# EAGLE design STHV800_breakout_board (EAGLE 9.1.3)
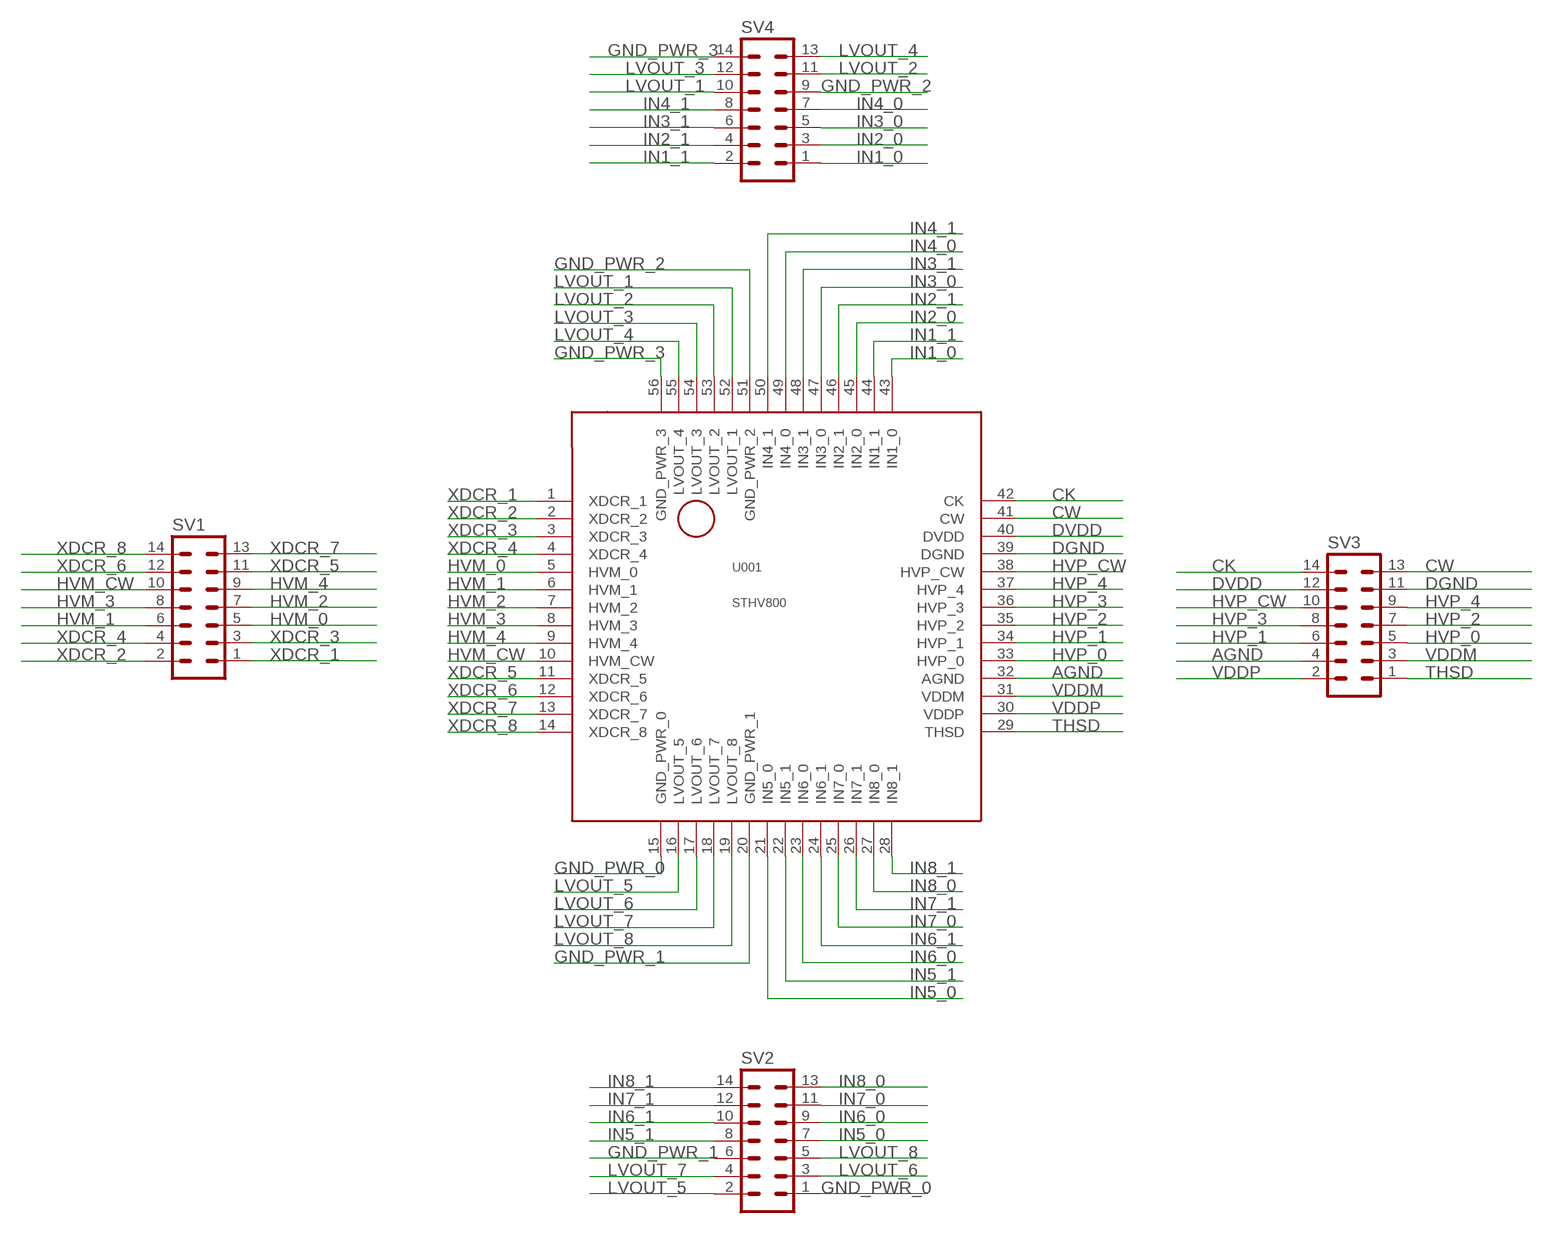
[diagram p0: schematic, sheet 1]

## Parts
SV1  MA07-2  [MA07-2]
SV2  MA07-2  [MA07-2]
SV3  MA07-2  [MA07-2]
SV4  MA07-2  [MA07-2]
U001  STHV800  [STHV800]

## Nets
AGND: SV3.4 U001.32(AGND)
CK: SV3.14 U001.42(CK)
CW: SV3.13 U001.41(CW)
DGND: SV3.11 U001.39(DGND)
DVDD: SV3.12 U001.40(DVDD)
GND_PWR_0: SV2.1 U001.15(GND_PWR_0)
GND_PWR_1: SV2.6 U001.20(GND_PWR_1)
GND_PWR_2: SV4.9 U001.51(GND_PWR_2)
GND_PWR_3: SV4.14 U001.56(GND_PWR_3)
HVM_0: SV1.5 U001.5(HVM_0)
HVM_1: SV1.6 U001.6(HVM_1)
HVM_2: SV1.7 U001.7(HVM_2)
HVM_3: SV1.8 U001.8(HVM_3)
HVM_4: SV1.9 U001.9(HVM_4)
HVM_CW: SV1.10 U001.10(HVM_CW)
HVP_0: SV3.5 U001.33(HVP_0)
HVP_1: SV3.6 U001.34(HVP_1)
HVP_2: SV3.7 U001.35(HVP_2)
HVP_3: SV3.8 U001.36(HVP_3)
HVP_4: SV3.9 U001.37(HVP_4)
HVP_CW: SV3.10 U001.38(HVP_CW)
IN1_0: SV4.1 U001.43(IN1_0)
IN1_1: SV4.2 U001.44(IN1_1)
IN2_0: SV4.3 U001.45(IN2_0)
IN2_1: SV4.4 U001.46(IN2_1)
IN3_0: SV4.5 U001.47(IN3_0)
IN3_1: SV4.6 U001.48(IN3_1)
IN4_0: SV4.7 U001.49(IN4_0)
IN4_1: SV4.8 U001.50(IN4_1)
IN5_0: SV2.7 U001.21(IN5_0)
IN5_1: SV2.8 U001.22(IN5_1)
IN6_0: SV2.9 U001.23(IN6_0)
IN6_1: SV2.10 U001.24(IN6_1)
IN7_0: SV2.11 U001.25(IN7_0)
IN7_1: SV2.12 U001.26(IN7_1)
IN8_0: SV2.13 U001.27(IN8_0)
IN8_1: SV2.14 U001.28(IN8_1)
LVOUT_1: SV4.10 U001.52(LVOUT_1)
LVOUT_2: SV4.11 U001.53(LVOUT_2)
LVOUT_3: SV4.12 U001.54(LVOUT_3)
LVOUT_4: SV4.13 U001.55(LVOUT_4)
LVOUT_5: SV2.2 U001.16(LVOUT_5)
LVOUT_6: SV2.3 U001.17(LVOUT_6)
LVOUT_7: SV2.4 U001.18(LVOUT_7)
LVOUT_8: SV2.5 U001.19(LVOUT_8)
THSD: SV3.1 U001.29(THSD)
VDDM: SV3.3 U001.31(VDDM)
VDDP: SV3.2 U001.30(VDDP)
XDCR_1: SV1.1 U001.1(XDCR_1)
XDCR_2: SV1.2 U001.2(XDCR_2)
XDCR_3: SV1.3 U001.3(XDCR_3)
XDCR_4: SV1.4 U001.4(XDCR_4)
XDCR_5: SV1.11 U001.11(XDCR_5)
XDCR_6: SV1.12 U001.12(XDCR_6)
XDCR_7: SV1.13 U001.13(XDCR_7)
XDCR_8: SV1.14 U001.14(XDCR_8)

## Library data of the parts
SV1-SV4 = con-lstb:MA07-2: PIN HEADER; OC_FARNELL: unknown; OC_NEWARK: unknown
U001 = STHV800:STHV800

## Board
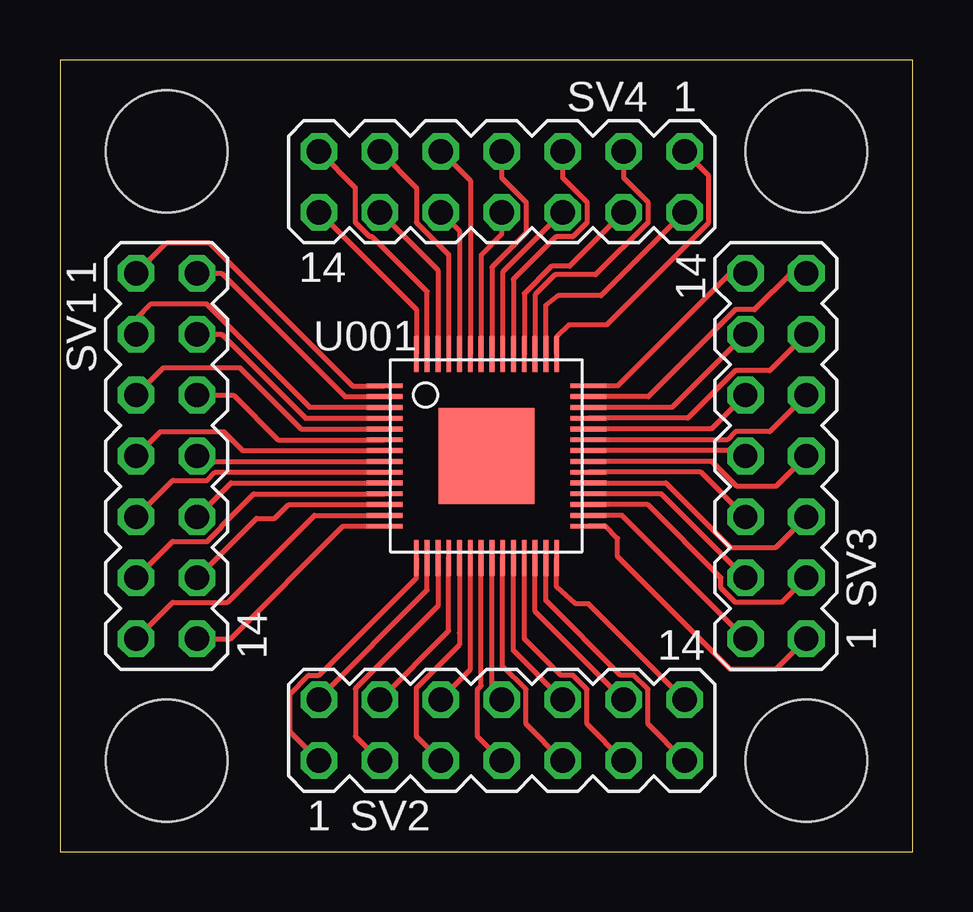
[diagram p1: board, top side]

Size 35.56 x 33.02 mm. Coordinates in mm from the lower left corner, seen from the top.
Outline: 0,0 35.56,0 35.56,33.02 0,33.02 0,0
Copper layers (1*16): Top 0.035mm / dielectric 1.5mm / Bottom 0.035mm
Design rules "default": minimum track width 6mil, minimum drill 0.35mm, track to track 6mil, track to pad 6mil, pad to pad 6mil, via to via 6mil, smd to smd 6mil, copper to edge 40mil, drill to drill 6mil, minimum pad ring 10mil, minimum via ring 8mil, stop-mask expansion 4mil, vias tented up to drill 0mil, thermal gap 10mil
Holes 5.08 mm at 4.45,29.21 31.11,29.21 31.11,3.81 4.45,3.81

### Footprints (pad centres in the part's own frame; a part is rotated, then mirrored left to right if it is on the bottom)
MA07-2 = drill 1.016 octagon: 1 -7.62,-1.27; 2 -7.62,1.27; 3 -5.08,-1.27; 4 -5.08,1.27; 5 -2.54,-1.27; 6 -2.54,1.27; 7 0,-1.27; 8 0,1.27; 9 2.54,-1.27; 10 2.54,1.27; 11 5.08,-1.27; 12 5.08,1.27; 13 7.62,-1.27; 14 7.62,1.27
STHV800 = smd 1.5 x 0.2: 1 -4.25,2.925; 2 -4.25,2.475; 3 -4.25,2.025; 4 -4.25,1.575; 5 -4.25,1.125; 6 -4.25,0.675; 7 -4.25,0.225; 8 -4.25,-0.225; 9 -4.25,-0.675; 10 -4.25,-1.125; 11 -4.25,-1.575; 12 -4.25,-2.025; 13 -4.25,-2.475; 14 -4.25,-2.925; 29 4.25,-2.925; 30 4.25,-2.475; 31 4.25,-2.025; 32 4.25,-1.575; 33 4.25,-1.125; 34 4.25,-0.675; 35 4.25,-0.225; 36 4.25,0.225; 37 4.25,0.675; 38 4.25,1.125; 39 4.25,1.575; 40 4.25,2.025; 41 4.25,2.475; 42 4.25,2.925 | smd 0.2 x 1.5: 15 -2.925,-4.25; 16 -2.475,-4.25; 17 -2.025,-4.25; 18 -1.575,-4.25; 19 -1.125,-4.25; 20 -0.675,-4.25; 21 -0.225,-4.25; 22 0.225,-4.25; 23 0.675,-4.25; 24 1.125,-4.25; 25 1.575,-4.25; 26 2.025,-4.25; 27 2.475,-4.25; 28 2.925,-4.25; 43 2.925,4.25; 44 2.475,4.25; 45 2.025,4.25; 46 1.575,4.25; 47 1.125,4.25; 48 0.675,4.25; 49 0.225,4.25; 50 -0.225,4.25; 51 -0.675,4.25; 52 -1.125,4.25; 53 -1.575,4.25; 54 -2.025,4.25; 55 -2.475,4.25; 56 -2.925,4.25 | smd 4 x 4: SUB 0,0

### Placement (x,y rotation side)
SV1  4.45,16.51 270 top
SV2  18.41,5.08 0 top
SV3  29.84,16.51 90 top
SV4  18.41,27.94 180 top
U001  17.78,16.51 0 top

### Tracks (layer width: path | path; a pad name or v marks a point on that pad's centre or on a via)
AGND
  Top 0.203: SV3.4 25.07,14.94 U001.32
CK
  Top 0.203: SV3.14 27.94,24.13 23.25,19.43 U001.42
CW
  Top 0.203: SV3.13 30.48,24.13 28.96,22.61 28.15,22.61 24.53,18.98 U001.41
DGND
  Top 0.203: SV3.11 29.59,20.07 28.15,20.07 26.17,18.09 U001.39
DVDD
  Top 0.203: SV3.12 25.52,18.54 U001.40
GND_PWR_0
  Top 0.203: U001.15 14.86,11.81 14.86,11.43 10.79,7.37 10.37,7.37 9.59,6.58 9.59,5.02 SV2.1
GND_PWR_1
  Top 0.203: U001.20 17.11,7.62 15.88,6.39 SV2.6
GND_PWR_2
  Top 0.203: SV4.9 17.11,27.98 U001.51
GND_PWR_3
  Top 0.203: SV4.14 14.86,22.61 U001.56
HVM_0
  Top 0.203: U001.5 10.05,17.64 7.49,20.19 4.32,20.19 SV1.5
HVM_1
  Top 0.203: U001.6 9.1,17.18 7.24,19.05 SV1.6
HVM_2
  Top 0.203: U001.7 7.62,16.73 6.83,17.53 4.19,17.53 SV1.7
HVM_3
  Top 0.203: SV1.8 5.94,16.29 U001.8
HVM_4
  Top 0.203: SV1.9 4.7,15.49 6.14,15.49 6.48,15.84 U001.9
HVM_CW
  Top 0.203: SV1.10 7.13,15.38 U001.10
HVP_0
  Top 0.203: SV3.5 29.84,12.7 27.94,12.7 25.25,15.38 U001.33
HVP_1
  Top 0.203: SV3.6 26.71,15.84 U001.34
HVP_2
  Top 0.203: U001.35 27.18,16.29 28.22,15.24 29.84,15.24 SV3.7
HVP_3
  Top 0.203: SV3.8 28.28,16.51 28.05,16.73 U001.36
HVP_4
  Top 0.203: SV3.9 29.59,17.53 28.15,17.53 27.81,17.18 U001.37
HVP_CW
  Top 0.203: SV3.10 27.16,17.64 U001.38
IN1_0
  Top 0.203: U001.43 20.7,21.47 21.21,21.97 22.77,21.97 27.05,26.25 27.05,28.19 SV4.1
IN1_1
  Top 0.203: U001.44 20.25,22.8 20.77,23.19 22.56,23.19 SV4.2
IN2_0
  Top 0.203: U001.45 19.8,23.23 20.64,24.07 22.33,24.07 24.51,26.25 24.51,27.09 23.5,28.11 SV4.3
IN2_1
  Top 0.203: SV4.4 21.25,24.42 20.49,24.42 19.36,23.29 U001.46
IN3_0
  Top 0.203: U001.47 18.91,23.88 20.68,25.65 21.38,25.65 21.97,26.25 21.97,27.09 20.95,28.11 SV4.5
IN3_1
  Top 0.203: SV4.6 18.45,24.17 U001.48
IN4_0
  Top 0.203: U001.49 18,24.38 19.43,25.81 19.43,27.09 18.41,28.11 SV4.7
IN4_1
  Top 0.203: U001.50 17.55,24.89 18.41,25.75 SV4.8
IN5_0
  Top 0.203: SV2.7 17.4,4.83 17.4,6.77 17.55,6.93 U001.21
IN5_1
  Top 0.203: SV2.8 18,6.76 U001.22
IN6_0
  Top 0.203: SV2.9 19.43,5.33 19.43,6.77 18.45,7.75 U001.23
IN6_1
  Top 0.203: SV2.10 18.91,8.4 U001.24
IN7_0
  Top 0.203: U001.25 19.36,8.89 20.88,7.37 21.38,7.37 21.97,6.77 21.97,5.33 SV2.11
IN7_1
  Top 0.203: SV2.12 19.8,10.04 U001.26
IN8_0
  Top 0.203: SV2.13 24.51,5.33 24.51,6.77 23.92,7.37 23.37,7.37 20.25,10.48 U001.27
IN8_1
  Top 0.203: U001.28 20.7,11.04 21.5,10.35 22.04,10.35 SV2.14
LVOUT_1
  Top 0.203: SV4.10 16.66,25.89 U001.52
LVOUT_2
  Top 0.203: SV4.11 14.86,27.69 14.86,26.25 16.2,24.9 U001.53
LVOUT_3
  Top 0.203: SV4.12 15.76,24.25 U001.54
LVOUT_4
  Top 0.203: SV4.13 12.32,27.69 12.32,26.25 12.91,25.65 13.02,25.65 15.3,23.37 U001.55
LVOUT_5
  Top 0.203: U001.16 15.3,10.92 10.79,6.41 SV2.2
LVOUT_6
  Top 0.203: SV2.3 12.32,4.83 12.32,6.82 15.76,10.25 U001.17
LVOUT_7
  Top 0.203: SV2.4 16.2,9.22 U001.18
LVOUT_8
  Top 0.203: U001.19 16.66,9.14 16.66,8.64 14.86,6.84 14.86,5.08 | SV2.5 14.86,4.83 14.86,5.08 | 14.86,5.08 14.86,6.59
THSD
  Top 0.203: U001.29 22.74,13.59 23.24,13.08 23.24,12.32 27.94,7.62 29.84,7.62 SV3.1
VDDM
  Top 0.203: SV3.3 30.1,10.41 28.15,10.41 27.56,11.01 27.56,11.43 24.5,14.48 U001.31
VDDP
  Top 0.203: SV3.2 23.43,14.04 U001.30
XDCR_1
  Top 0.203: U001.1 12.19,19.43 6.22,25.4 4.45,25.4 SV1.1
XDCR_2
  Top 0.203: U001.2 11.88,18.98 6.73,24.13 SV1.2
XDCR_3
  Top 0.203: U001.3 10.42,18.54 6.1,22.86 3.81,22.86 3.17,22.23 SV1.3
XDCR_4
  Top 0.203: U001.4 10.24,18.09 6.73,21.59 SV1.4
XDCR_5
  Top 0.203: U001.11 8.08,14.94 6.73,13.59 6.73,13.55 6.14,12.95 4.7,12.95 SV1.11
XDCR_6
  Top 0.203: U001.12 9.53,14.48 8.95,13.91 8.19,13.91 SV1.12
XDCR_7
  Top 0.203: U001.13 10.61,14.04 6.99,10.41 4.7,10.41 SV1.13
XDCR_8
  Top 0.203: U001.14 11.81,13.59 7.11,8.89 SV1.14